# EAGLE design FiltreFSK_TI (EAGLE 6.4)
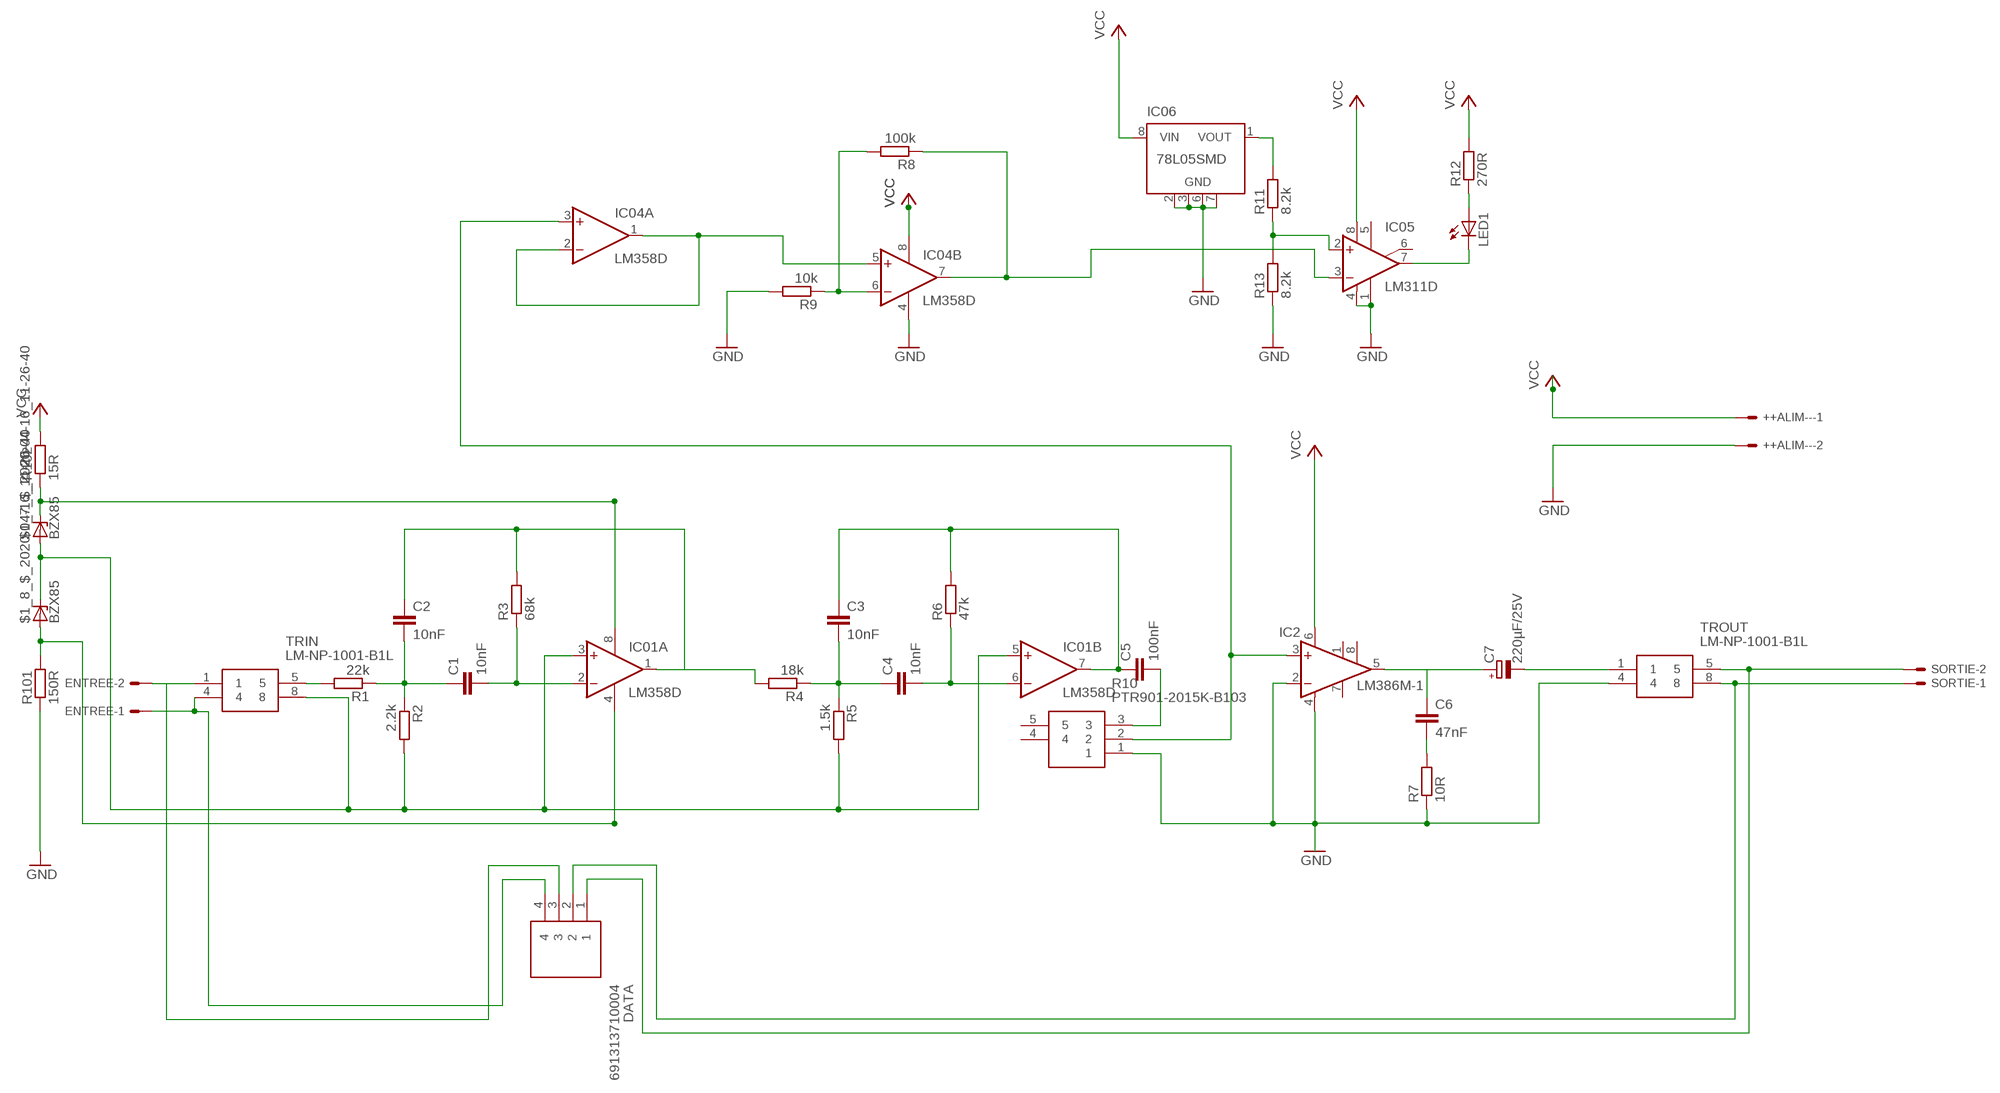
[diagram p0: schematic, sheet 1]

## Parts
$1_7_$_2020-04-16_11-26-40  BZX85  [DO41Z10]
$1_8_$_2020-04-16_11-26-40  BZX85  [DO41Z10]
++ALIM--  KK-156-2  [KK-156-2]
C1  10nF  C-EUC1206  [C1206]
C2  10nF  C-EUC1206  [C1206]
C3  10nF  C-EUC1206  [C1206]
C4  10nF  C-EUC1206  [C1206]
C5  100nF  C-EUC1206  [C1206]
C6  47nF  C-EUC1206  [C1206]
C7  220µF/25V  CPOL-EUE3.5-8  [E3,5-8]
DATA  691313710004  [SHDR4W140P0X500_1X4_2200X1200X]
ENTREE  KK-156-2  [KK-156-2]
IC01  LM358D  [SO08]
IC2  LM386M-1  [SO08]
IC04  LM358D  [SO08]
IC05  LM311D  [SO08]
IC06  78L05SMD  [SO08]
LED1  LED5MM  [LED5MM]
R1  22k  R-EU_R1206  [R1206]
R2  2.2k  R-EU_R1206  [R1206]
R3  68k  R-EU_R1206  [R1206]
R4  18k  R-EU_R1206  [R1206]
R5  1.5k  R-EU_R1206  [R1206]
R6  47k  R-EU_R1206  [R1206]
R7  10R  R-EU_R1206  [R1206]
R8  100k  R-EU_R1206  [R1206]
R9  10k  R-EU_R1206  [R1206]
R10  PTR901-2015K-B103  [PTR9012015KB103]
R11  8.2k  R-EU_R1210  [R1210]
R12  270R  R-EU_R1206  [R1206]
R13  8.2k  R-EU_R1210  [R1210]
R101  150R  R-EU_0207/10  [0207/10]
R102  15R  R-EU_0207/10  [0207/10]
SORTIE  KK-156-2  [KK-156-2]
TRIN  LM-NP-1001-B1L  [LMNP1001B1L]
TROUT  LM-NP-1001-B1L  [LMNP1001B1L]

## Nets
GND: ++ALIM--.2 IC2.2(-IN) IC2.4(GND) IC04.4(P:V-) IC05.1(GND) IC05.4(V-) IC06.2(GND) IC06.3(GND) IC06.6(GND) IC06.7(GND) R7.1 R9.2 R10.1 R13.1 R101.1 TROUT.4
N$1: DATA.3 ENTREE.2 TRIN.1
N$2: $1_7_$_2020-04-16_11-26-40.A $1_8_$_2020-04-16_11-26-40.C IC01.3(A:+IN) IC01.5(B:+IN) R2.2 R5.2 TRIN.8
N$3: $1_8_$_2020-04-16_11-26-40.A IC01.4(P:V-) R101.2
N$4: C1.1 C2.2 R1.1 R2.1
N$5: C2.1 IC01.1(A:OUT) R3.2 R4.2
N$6: C1.2 IC01.2(A:-IN) R3.1
N$7: DATA.4 ENTREE.1 TRIN.4
N$8: IC2.3(+IN) IC04.3(A:+IN) R10.2
N$9: C6.2 R7.2
N$10: C5.2 R10.3
N$11: DATA.2 SORTIE.1 TROUT.8
N$12: C6.1 C7.+ IC2.5(OUT)
N$13: R1.2 TRIN.5
N$14: C7.- TROUT.1
N$16: IC04.7(B:OUT) IC05.3(-IN) R8.1
N$17: $1_7_$_2020-04-16_11-26-40.C IC01.8(P:V+) R102.1
N$18: IC04.6(B:-IN) R8.2 R9.1
N$19: IC05.7(OUT) LED1.K(C)
N$20: LED1.A R12.1
N$21: IC06.1(VOUT) R11.2
N$22: DATA.1 SORTIE.2 TROUT.5
N$23: IC05.2(+IN) R11.1 R13.2
N$24: IC04.1(A:OUT) IC04.2(A:-IN) IC04.5(B:+IN)
N$30: C3.2 C4.1 R4.1 R5.1
N$31: C3.1 C5.1 IC01.7(B:OUT) R6.2
N$32: C4.2 IC01.6(B:-IN) R6.1
VCC: ++ALIM--.1 IC2.6(VS) IC04.8(P:V+) IC05.8(V+) IC06.8(VIN) R12.2 R102.2
Unconnected: IC2.1(GAIN) IC2.7(BYPASS) IC2.8(GAIN) IC05.5(ON) IC05.6(ON/STR) IC06.4(NC) IC06.5(NC) R10.4 R10.5

## Library data of the parts
$1_7_$_2020-04-16_11-26-40 $1_8_$_2020-04-16_11-26-40 = diode:BZX85: Z DIODE
++ALIM-- ENTREE SORTIE = con-molex:KK-156-2: KK 156 HEADER Source: http://www.molex.com/pdm_docs/sd/026604100_sd.pdf; OC_FARNELL: unknown; OC_NEWARK: unknown
C1-C6 = rcl:C-EU: CAPACITOR, European symbol
C7 = rcl:CPOL-EU: POLARIZED CAPACITOR, European symbol
DATA = 691313710004:691313710004: WR-TBL Terminal block - serie 3137 Source: Datasheet <http://katalog.we-online.de/em/datasheet/6913137100xx.pdf>; DESCRIPTION: WR-TBL Terminal block - serie 3137; HEIGHT: 8.7mm; MANUFACTURER_NAME: Wurth Elektronik; MANUFACTURER_PART_NUMBER: 691313710004; MOUSER_PART_NUMBER: 710-691313710004; MOUSER_PRICE-STOCK: https://www.mouser.com/Search/Refine.aspx?Keyword=710-691313710004; RS_PART_NUMBER: 8246576; RS_PRICE-STOCK: http://uk.rs-online.com/web/p/products/8246576
IC01 IC04 = linear:LM358: OP AMP also LM158; LM258; LM2904 Source: http://cache.national.com/ds/LM/LM158.pdf
IC2 = linear:LM386?-*: Low Voltage Audio Power Amplifier Source: http://cache.national.com/ds/LM/LM386.pdf
IC05 = linear:LM311: COMPARATOR
IC06 = linear:78L*SMD: Positive VOLTAGE REGULATOR
LED1 = led:LED: LED OSRAM: - CHIPLED LG R971, LG N971, LY N971, LG Q971, LY Q971, LO R971, LY R971 LH N974, LH R974 LS Q976, LO Q976, LY Q976 LO Q996 - Hyper CHIPLED LW Q18S LB Q993, LB Q99A, LB R99A - SideLED LS A670, LO A670, LY A670, LG A670, LP A670 LB A673, LV A673, LT A673, LW A673 LH A674 LY A675 LS A676, LA A676, LO A676, LY A676, LW A676 LS A679, LY A679, LG A679 - Hyper Micro SIDELED® LS Y876, LA Y876, LO Y876, LY Y876 LT Y87S - SmartLED LW L88C, LW L88S LB L89C, LB L89S, LG L890 LS L89K, LO L89K, LY L89K LS L896, LA L896, LO L896, LY L896 - TOPLED LS T670, LO T670, LY T670, LG T670, LP T670 LSG T670, LSP T670, LSY T670, LOP T670, LYG T670 LG T671, LOG T671, LSG T671 LB T673, LV T673, LT T673, LW T673 LH T674 LS T676, LA T676, LO T676, LY T676, LB T676, LH T676, LSB T676, LW T676 LB T67C, LV T67C, LT T67C, LS T67K, LO T67K, LY T67K, LW E67C LS E67B, LA E67B, LO E67B, LY E67B, LB E67C, LV E67C, LT E67C LW T67C LS T679, LY T679, LG T679 LS T770, LO T770, LY T770, LG T770, LP T770 LB T773, LV T773, LT T773, LW T773 LH T774 LS E675, LA E675, LY E675, LS T675 LS T776, LA T776, LO T776, LY T776, LB T776 LHGB T686 LT T68C, LB T68C - Hyper Mini TOPLED® LB M676 - Mini TOPLED Santana® LG M470 LS M47K, LO M47K, LY M47K Source: http://www.osram.convergy.de LUXEON: - LUMILED® LXK2-PW12-R00, LXK2-PW12-S00, LXK2-PW14-U00, LXK2-PW14-V00 LXK2-PM12-R00, LXK2-PM12-S00, LXK2-PM14-U00 LXK2-PE12-Q00, LXK2-PE12-R00, LXK2-PE12-S00, LXK2-PE14-T00, LXK2-PE14-U00 LXK2-PB12-K00, LXK2-PB12-L00, LXK2-PB12-M00, LXK2-PB14-N00, LXK2-PB14-P00, LXK2-PB14-Q00 LXK2-PR12-L00, LXK2-PR12-M00, LXK2-PR14-Q00, LXK2-PR14-R00 LXK2-PD12-Q00, LXK2-PD12-R00, LXK2-PD12-S00 LXK2-PH12-R00, LXK2-PH12-S00 LXK2-PL12-P00, LXK2-PL12-Q00, LXK2-PL12-R00 Source: www.luxeon.com KINGBRIGHT: KA-3528ASYC Source: www.kingbright.com
R1-R9 R11-R13 R101 R102 = rcl:R-EU_: RESISTOR, European symbol
R10 = PTR901-2015K-B103:PTR901-2015K-B103: Bourns PTR901-2015K-B103 Rotary Carbon Potentiometer 1 Gang with a 6 mm Dia. Shaft, Through Hole, 10k +/-10%, 0.05W Source: Datasheet <https://www.bourns.com/docs/product-datasheets/PTR90.pdf>; ALLIED_NUMBER: 71279411; ALLIED_PRICE-STOCK: https://www.alliedelec.com/bourns-ptr901-2015k-b103/71279411/; DESCRIPTION: Bourns PTR901-2015K-B103 Rotary Carbon Potentiometer 1 Gang with a 6 mm Dia. Shaft, Through Hole, 10k +/-10%, 0.05W; HEIGHT: mm; MANUFACTURER_NAME: Bourns; MANUFACTURER_PART_NUMBER: PTR901-2015K-B103; MOUSER_PART_NUMBER: 652-PTR901-2015KB103; MOUSER_PRICE-STOCK: https://www.mouser.com/Search/Refine.aspx?Keyword=652-PTR901-2015KB103; RS_PART_NUMBER: 8275003P; RS_PRICE-STOCK: http://uk.rs-online.com/web/p/products/8275003P
TRIN TROUT = LM-NP-1001-B1L:LM-NP-1001-B1L: BOURNS - LM-NP-1001-B1L - TRANSFORMER, LINE-MATCHING 1:1, 2.8H Source: Datasheet <https://www.bourns.com/pdfs/LMNPLP.pdf>; ALLIED_NUMBER: 70154707; ALLIED_PRICE-STOCK: https://www.alliedelec.com/bourns-lm-np-1001-b1l/70154707/; DESCRIPTION: BOURNS - LM-NP-1001-B1L - TRANSFORMER, LINE-MATCHING 1:1, 2.8H; HEIGHT: 12mm; MANUFACTURER_NAME: Bourns; MANUFACTURER_PART_NUMBER: LM-NP-1001-B1L; MOUSER_PART_NUMBER: 652-LM-NP-1001-B1L; MOUSER_PRICE-STOCK: https://www.mouser.com/Search/Refine.aspx?Keyword=652-LM-NP-1001-B1L; RS_PART_NUMBER: 1740620; RS_PRICE-STOCK: http://uk.rs-online.com/web/p/products/1740620

## Board
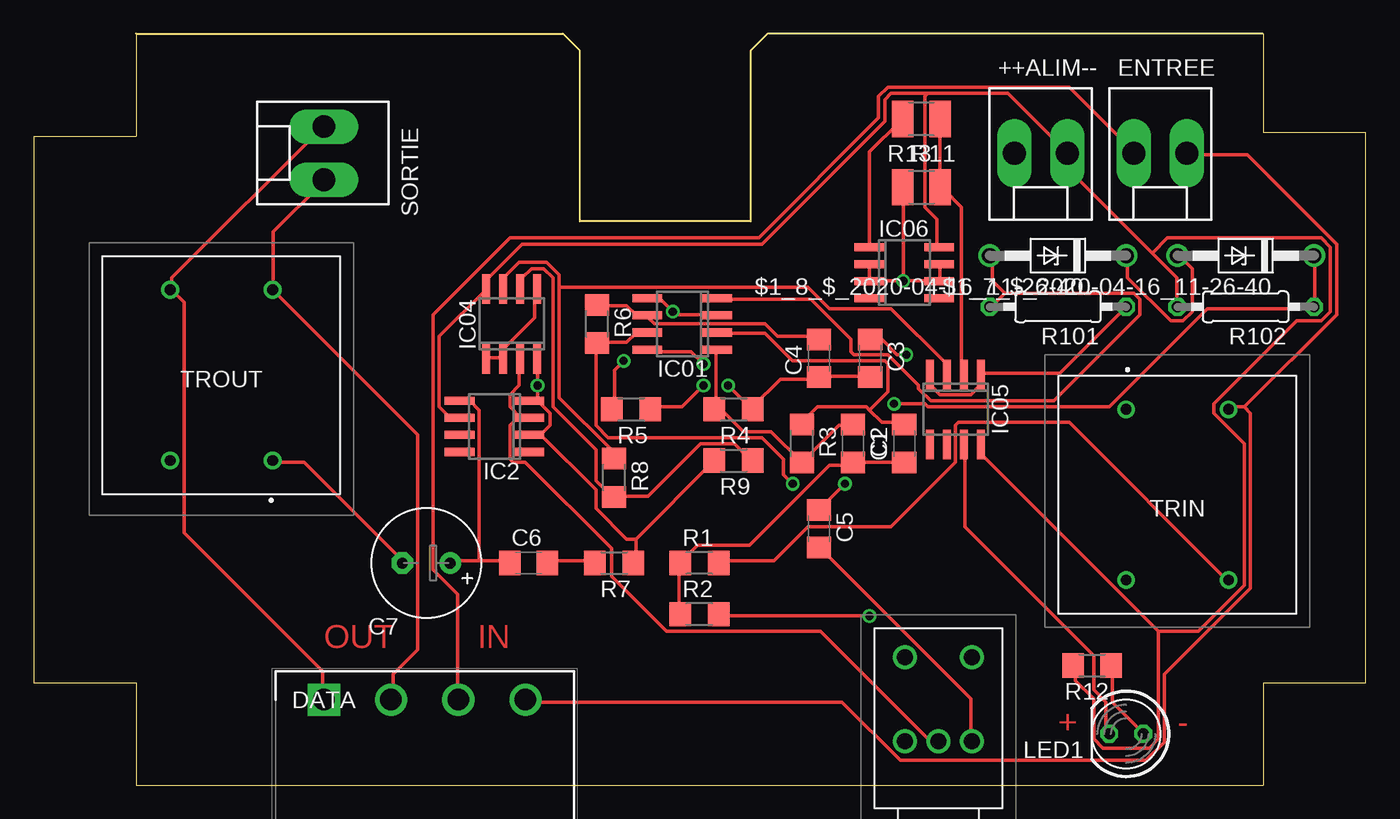
[diagram p1: board, top side]
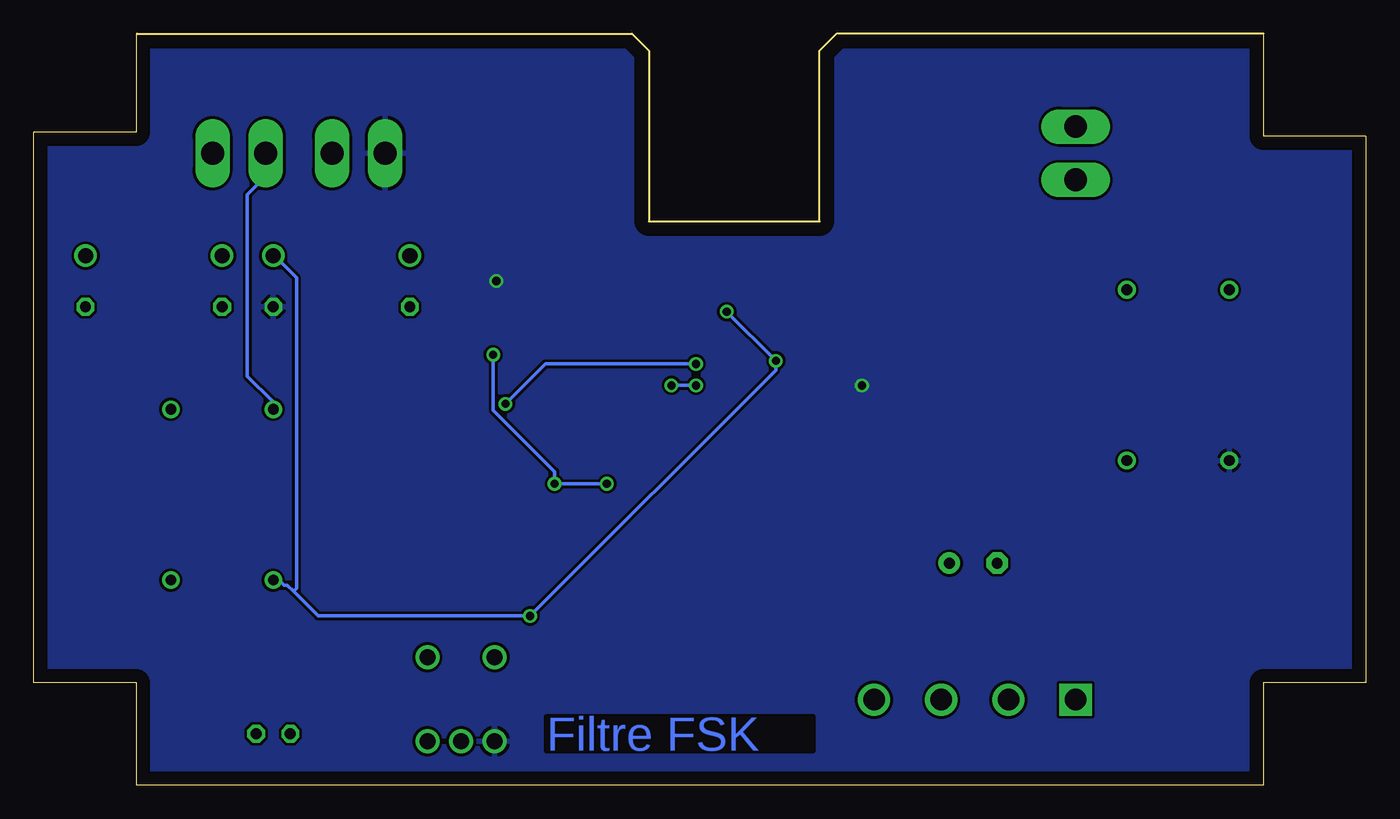
[diagram p2: board, bottom side, seen from below]

Size 99.11 x 55.88 mm. Coordinates in mm from the lower left corner, seen from the top.
Outline: 91.49,55.88 91.49,48.56 99.11,48.56 99.11,7.62 91.49,7.62 91.49,0 7.62,0 7.62,7.62 0,7.62 0,48.26 7.62,48.26 7.62,55.88 39.37,55.88 40.64,54.61 40.64,41.91 53.34,41.91 53.34,54.61 54.61,55.88 91.44,55.88
Copper layers (1*16): Top 0.035mm / dielectric 1.5mm / Bottom 0.035mm
Design rules "default": minimum track width 10mil, minimum drill 24mil, track to track 8mil, track to pad 8mil, pad to pad 8mil, via to via 8mil, smd to smd 8mil, copper to edge 40mil, drill to drill 8mil, minimum pad ring 10mil, minimum via ring 8mil, stop-mask expansion 4mil, vias tented up to drill 0mil, thermal gap 10mil

### Footprints (pad centres in the part's own frame; a part is rotated, then mirrored left to right if it is on the bottom)
DO41Z10 = drill 1.118: A 5.08,0; C -5.08,0
KK-156-2 = drill 1.7 pad 2.184 long: 1 -1.98,0; 2 1.98,0
C1206 = smd 1.6 x 1.8: 1 -1.4,0; 2 1.4,0
E3,5-8 = drill 0.813 pad 1.6: + -1.778,0 | drill 0.813 pad 1.6 octagon: - 1.778,0
SHDR4W140P0X500_1X4_2200X1200X = drill 1.6 pad 2.4 square: 1 0,0 | drill 1.6 pad 2.4: 2 5,0; 3 10,0; 4 15,0
SO08 = smd 0.6 x 2.2: 1 -1.905,-2.6; 2 -0.635,-2.6; 3 0.635,-2.6; 4 1.905,-2.6; 5 1.905,2.6; 6 0.635,2.6; 7 -0.635,2.6; 8 -1.905,2.6
LED5MM = drill 0.813 octagon: A -1.27,0; K 1.27,0
R1206 = smd 1.6 x 1.803: 1 -1.422,0; 2 1.422,0
PTR9012015KB103 = drill 1.2 pad 1.8: 1 -5.8,-2.5; 2 -5.8,0; 3 -5.8,2.5; 4 -12.05,-2.5; 5 -12.05,2.5
R1210 = smd 1.6 x 2.7: 1 -1.4,0; 2 1.4,0
0207/10 = drill 0.813 octagon: 1 -5.08,0; 2 5.08,0
LMNP1001B1L = drill 0.8 pad 1.3: 1 3.81,-6.35; 4 -3.81,-6.35; 5 -3.81,6.35; 8 3.81,6.35

### Placement (x,y rotation side)
$1_7_$_2020-04-16_11-26-40  90.17,39.37 180 top
$1_8_$_2020-04-16_11-26-40  76.2,39.37 180 top
++ALIM--  74.93,46.99 180 top
C1  64.77,25.4 90 top
C2  60.96,25.4 270 top
C3  62.23,31.75 270 top
C4  58.42,31.75 90 top
C5  58.42,19.05 270 top
C6  36.83,16.51 0 top
C7  29.21,16.51 180 top
DATA  21.59,6.35 0 top
ENTREE  83.82,46.99 180 top
IC01  48.26,34.29 90 top
IC2  34.29,26.67 90 top
IC04  35.56,34.29 0 top
IC05  68.58,27.94 180 top
IC06  64.77,38.1 270 top
LED1  81.28,3.81 180 top
R1  49.53,16.51 0 top
R2  49.53,12.7 0 top
R3  57.15,25.4 270 top
R4  52.07,27.94 180 top
R5  44.45,27.94 180 top
R6  41.91,34.29 270 top
R7  43.18,16.51 180 top
R8  43.18,22.86 270 top
R9  52.07,24.13 180 top
R10  67.31,-2.54 270 top
R11  66.04,49.53 180 top
R12  78.74,8.89 180 top
R13  66.04,44.45 0 top
R101  76.2,35.56 180 top
R102  90.17,35.56 180 top
SORTIE  21.59,46.99 90 top
TRIN  85.09,21.59 180 top
TROUT  13.97,30.48 0 top

### Tracks (layer width: path | path; a pad name or v marks a point on that pad's centre or on a via)
GND  (via drill 0.61)
  Top 0.254: 37.72,26.06 37.03,26.06 IC2.2 37.72,26.06 | 37.72,26.06 38.41,26.75 38.41,27.66 37.49,28.57 | 37.49,28.57 IC2.4 37.03,28.57 | 37.49,28.57 v37.49,29.72 37.49,31.55 IC04.4 | 44.81,18.29 44.81,16.69 R7.1 | 44.81,18.29 50.52,24 R9.2 | 37.72,26.06 41.83,21.95 41.83,20.57 44.12,18.29 44.81,18.29 | 62.18,37.49 62.18,38.63 IC06.2 | IC06.7 67.44,38.63 67.44,37.49 IC06.6 67.21,37.49 v64.69,37.49 | v64.69,37.49 62.18,37.49 | 62.18,37.49 IC06.3 | v64.69,37.49 64.69,44.35 R13.1 | IC05.4 66.75,30.4 66.75,29.72 67.44,29.03 69.72,29.03 70.41,29.72 70.41,30.4 IC05.1 70.64,30.63 76.35,30.63 R101.1
  pour Bottom: 0,56 99.11,56 99.11,0 0,0
N$1
  Top 0.254: DATA.3 31.55,6.4 31.55,14.17 29.72,16 29.72,34.98 35.43,40.69 53.95,40.69 62.87,49.61 62.87,51.21 63.55,51.89 77.04,51.89 81.84,47.09 ENTREE.2
  Bottom 0.254: TRIN.1 81.38,28.12 81.38,28.57 83.21,30.4 83.21,43.89 82.07,45.03 82.07,46.86 ENTREE.2
N$2  (via drill 0.61)
  Top 0.254: v43.89,31.55 43.2,30.86 43.2,28.12 R5.2 | IC01.5 45.72,36.12 46.63,36.12 v47.55,35.2 47.78,34.98 50.75,34.98 IC01.3 | $1_8_$_2020-04-16_11-26-40.C 81.38,39.32 81.38,37.72 84.58,34.52 85.5,34.52 86.18,35.2 86.18,38.41 85.27,39.32 $1_7_$_2020-04-16_11-26-40.A | v62.18,12.57 50.98,12.57 R2.2
  Bottom 0.254: v47.55,35.2 v43.89,31.55 43.89,30.86 v62.18,12.57 77.95,12.57 79.78,14.4 | 79.78,14.4 80.24,14.86 80.47,14.86 80.7,15.09 81.15,15.09 TRIN.8 | 79.78,14.4 79.55,14.63 79.55,37.72 81.15,39.32 $1_8_$_2020-04-16_11-26-40.C
N$3
  Top 0.254: 72.24,36.58 81.84,36.58 82.3,36.12 82.3,34.98 75.89,28.57 66.75,28.57 65.84,29.49 65.84,29.72 63.55,32 61.04,32 60.81,32.23 60.81,33.15 57.84,36.12 50.98,36.12 IC01.4 | 72.24,36.58 71.32,35.66 R101.2 | 72.24,36.58 71.32,37.49 71.32,39.32 $1_8_$_2020-04-16_11-26-40.A
N$4
  Top 0.254: C1.1 64.69,24 61.04,24 C2.2 60.81,23.77 59.21,23.77 53.26,17.83 49.38,17.83 48.23,16.69 R1.1 48.01,16.46 48.01,12.8 R2.1
N$5
  Top 0.254: IC01.1 50.75,32.23 50.75,28.12 R4.2 50.75,27.89 51.21,27.89 52.81,26.29 54.86,26.29 57.15,24 | 57.15,24 59.89,26.75 60.81,26.75 C2.1 | 57.15,24 R3.2
N$6
  Top 0.254: 62.18,27.89 61.95,28.12 58.29,28.12 57.15,26.98 R3.1 | 62.18,27.89 63.09,26.98 64.69,26.98 C1.2 | 62.18,27.89 63.55,29.26 63.55,31.32 63.32,31.55 56.46,31.55 54.41,33.6 50.98,33.6 IC01.2
N$7
  Top 0.254: 90.07,28.12 88.92,28.12 TRIN.4 | 90.07,28.12 96.93,34.98 96.93,40.23 90.3,46.86 85.95,46.86 ENTREE.1 | 90.07,28.12 90.53,27.66 90.53,14.63 84.12,8.23 84.12,3.2 82.75,1.83 64.47,1.83 60.12,6.17 36.8,6.17 DATA.4
N$8
  Top 0.254: 36.12,27.43 35.43,28.12 35.43,29.03 36.12,29.72 36.12,31.55 IC04.3 | 36.12,27.43 36.8,27.43 IC2.3 36.12,27.43 | 36.12,27.43 35.43,26.75 35.43,24.23 35.66,24 36.58,24 42.98,17.6 42.98,15.54 47.09,11.43 58.52,11.43 66.52,3.43 67.21,3.43 R10.2
N$9
  Top 0.254: C6.2 38.41,16.69 41.6,16.69 R7.2
N$10
  Top 0.254: C5.2 58.52,17.6 69.72,6.4 69.72,3.43 R10.3
N$11
  Top 0.254: SORTIE.1 21.49,44.81 17.83,41.15 17.83,37.03 TROUT.8 17.83,36.8 28.57,26.06 28.57,10.06 26.75,8.23 26.75,6.4 DATA.2
N$12
  Top 0.254: 33.15,16.69 31.09,16.69 C7.+ | 33.15,16.69 35.2,16.69 C6.1 | IC2.5 32.46,28.57 33.15,27.89 33.15,16.69
N$13
  Top 0.254: R1.2 50.98,16.69 55.09,16.69 57.61,19.2 63.78,19.2 68.58,24 68.58,26.75 68.81,26.98 77.04,26.98 88.7,15.32 TRIN.5
N$14
  Top 0.254: TROUT.1 17.83,24 20.12,24 27.43,16.69 C7.-
N$16
  Top 0.254: 39.09,37.03 39.09,37.95 38.18,38.86 36.12,38.86 34.98,37.72 34.98,37.03 IC04.7 | 39.09,37.03 39.09,28.8 42.98,24.92 42.98,24.46 R8.1 | 39.09,37.03 57.61,37.03 59.21,35.43 63.78,35.43 67.89,31.32 67.89,30.63 IC05.3
N$17  (via drill 0.61)
  Top 0.254: v49.84,31.32 48.92,32.23 45.72,32.23 IC01.8 | v64.01,28.35 66.29,28.35 66.52,28.12 80.01,28.12 87.33,35.43 95.1,35.43 R102.1 95.33,35.66 95.33,39.32 $1_7_$_2020-04-16_11-26-40.C
  Bottom 0.254: v49.84,31.32 61.04,31.32 v64.01,28.35
N$18
  Top 0.254: R9.1 53.26,24.23 52.12,25.38 49.61,25.38 45.72,21.49 43.2,21.49 R8.2 42.98,21.49 41.83,22.63 41.83,24.92 38.63,28.12 38.63,37.72 37.95,38.41 37.03,38.41 36.35,37.72 36.35,37.03 IC04.6
N$19
  Top 0.254: IC05.7 69.27,25.15 69.27,19.2 78.87,9.6 78.87,7.09 79.78,6.17 79.78,4.12 80.01,3.89 LED1.K
N$20
  Top 0.254: R12.1 80.24,8.69 80.24,6.17 82.53,3.89 LED1.A
N$21
  Top 0.254: IC06.1 62.18,47.09 64.47,49.38 R11.2
N$22
  Top 0.254: SORTIE.2 21.49,48.92 10.29,37.72 10.29,37.03 TROUT.5 10.29,36.8 11.2,35.89 11.2,18.75 21.49,8.46 21.49,6.4 DATA.1
N$23
  Top 0.254: IC05.2 69.04,30.63 69.04,42.98 67.67,44.35 R13.2 67.44,44.58 67.44,49.38 R11.1
N$24
  Top 0.254: IC04.1 33.83,31.77 34.75,31.77 IC04.2 34.98,31.77 34.98,32.46 37.26,34.75 37.26,36.8 IC04.5
N$30  (via drill 0.61)
  Top 0.254: C3.2 62.18,30.4 58.52,30.4 C4.1 58.29,30.18 55.55,30.18 53.49,28.12 R4.1 53.26,28.12 v51.66,29.72 | v49.84,29.72 48.23,28.12 45.95,28.12 R5.1
  Bottom 0.254: v51.66,29.72 v49.84,29.72
N$31  (via drill 0.61)
  Top 0.254: IC01.7 45.49,33.6 44.81,33.6 44.12,32.92 42.06,32.92 R6.2 41.83,32.69 41.83,26.75 42.75,25.83 54.18,25.83 55.78,24.23 55.78,23.09 v56.46,22.4 | v60.35,22.4 58.52,20.57 C5.1 | v64.92,32 64.24,32 63.09,33.15 62.41,33.15 C3.1
  Bottom 0.254: v64.92,32 64.92,27.89 60.35,23.32 v60.35,22.4 v56.46,22.4
N$32
  Top 0.254: C4.2 58.29,33.38 55.32,33.38 54.41,34.29 46.18,34.29 45.72,34.75 IC01.6 45.49,34.98 44.81,34.98 44.12,35.66 42.06,35.66 R6.1
VCC
  Top 0.254: 83.67,11.43 83.67,3.43 82.98,2.74 79.55,2.74 78.87,3.43 78.87,6.4 77.5,7.77 77.5,8.69 R12.2 | 83.67,11.43 70.64,24.46 70.64,25.15 IC05.8 | IC2.6 31.55,27.43 30.86,27.43 30.18,28.12 30.18,33.38 33.6,36.8 IC04.8 33.83,37.03 33.83,37.72 36.35,40.23 54.18,40.23 63.32,49.38 63.32,50.98 63.78,51.44 66.52,51.44 | 66.52,51.44 66.29,51.21 66.29,42.98 67.21,42.06 67.21,40.01 IC06.8 | 66.52,51.44 72.47,51.44 76.81,47.09 ++ALIM--.1 77.04,46.86 77.04,45.72 83.21,39.55 | 83.21,39.55 85.04,37.72 85.04,35.66 R102.2 | 83.67,11.43 86.64,11.43 90.07,14.86 90.07,25.38 87.78,27.66 87.78,28.35 93.95,34.52 95.78,34.52 96.47,35.2 96.47,40.01 95.78,40.69 84.35,40.69 83.21,39.55

### Text on the board
Top: OUT | IN | + | -
Bottom: Filtre FSK
Document: Filtre FSK +25dB